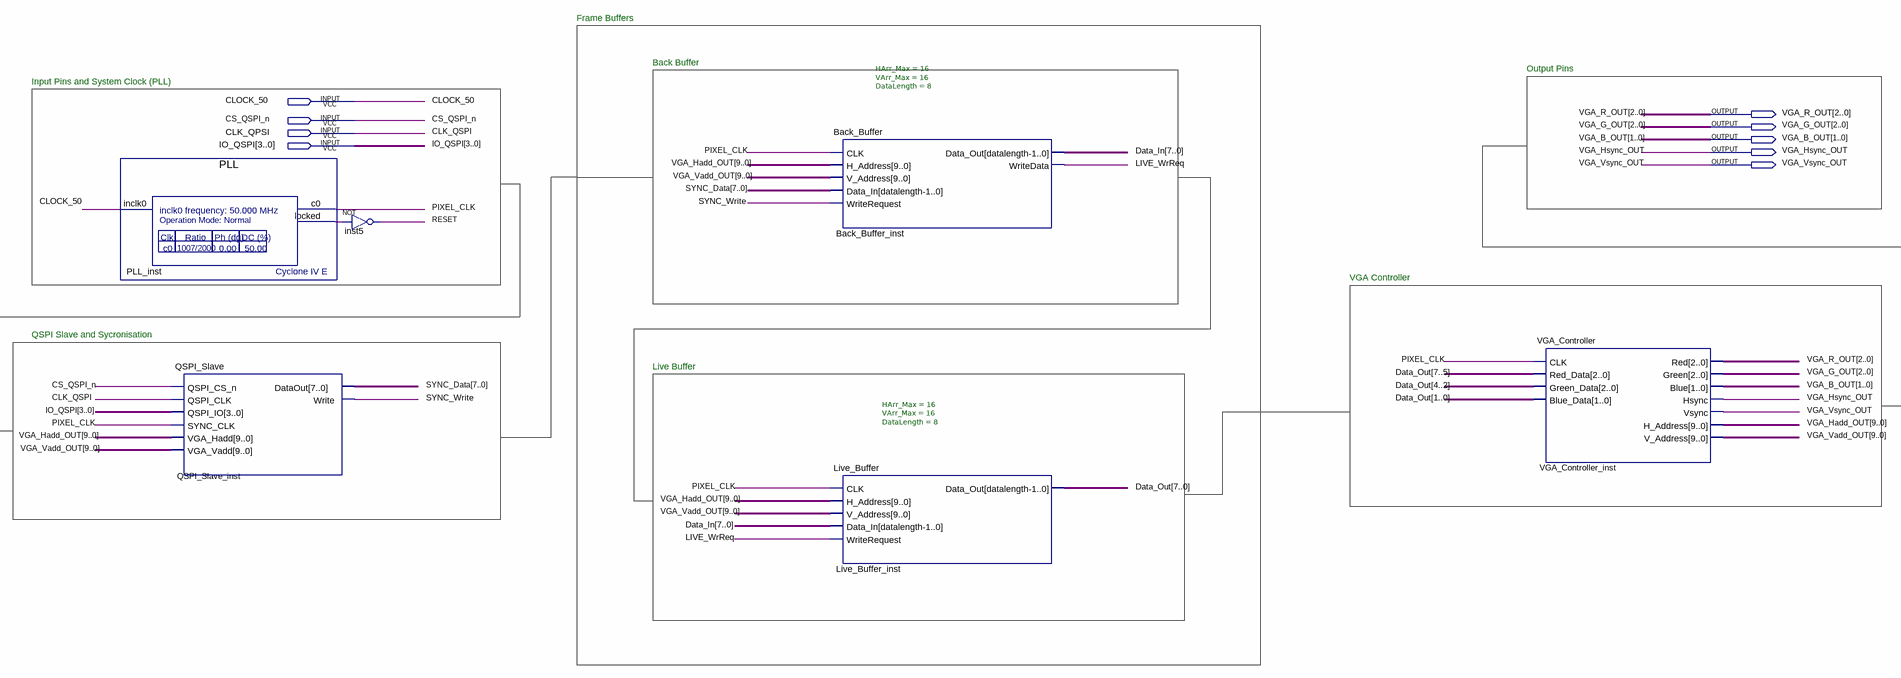
[diagram p0: schematic sheet]
// Quartus schematic FinalYearProject.bdf as structural Verilog: 6 symbols, 9 pins
module FinalYearProject (
  input  CLOCK_50,
  input  CS_QSPI_n,
  input  CLK_QPSI,
  input  [3:0] IO_QSPI,
  output [2:0] VGA_R_OUT,
  output [2:0] VGA_G_OUT,
  output [1:0] VGA_B_OUT,
  output VGA_Hsync_OUT,
  output VGA_Vsync_OUT
);

  wire LIVE_WrReq, PIXEL_CLK, PLL_inst_locked, RESET, SYNC_Write;
  wire [7:0] Data_In, Data_Out, SYNC_Data;
  wire [9:0] VGA_Hadd_OUT, VGA_Vadd_OUT;

  PLL PLL_inst (.inclk0(CLOCK_50), .c0(PIXEL_CLK), .locked(PLL_inst_locked));
  QSPI_Slave QSPI_Slave_inst (
    .QSPI_CS_n(CS_QSPI_n), .QSPI_CLK(CLK_QPSI), .QSPI_IO(IO_QSPI), .SYNC_CLK(PIXEL_CLK),
    .VGA_Hadd(VGA_Hadd_OUT), .VGA_Vadd(VGA_Vadd_OUT), .DataOut(SYNC_Data), .Write(SYNC_Write));
  not inst5 (RESET, PLL_inst_locked);
  Back_Buffer #(.HArr_Max(16), .VArr_Max(16), .DataLength(8)) Back_Buffer_inst (
    .CLK(PIXEL_CLK), .H_Address(VGA_Hadd_OUT), .V_Address(VGA_Vadd_OUT), .Data_In(SYNC_Data),
    .WriteRequest(SYNC_Write), .Data_Out(Data_In), .WriteData(LIVE_WrReq));
  Live_Buffer #(.HArr_Max(16), .VArr_Max(16), .DataLength(8)) Live_Buffer_inst (
    .CLK(PIXEL_CLK), .H_Address(VGA_Hadd_OUT), .V_Address(VGA_Vadd_OUT), .Data_In(Data_In),
    .WriteRequest(LIVE_WrReq), .Data_Out(Data_Out));
  VGA_Controller VGA_Controller_inst (
    .CLK(PIXEL_CLK), .Red_Data(Data_Out[7:5]), .Green_Data(Data_Out[4:2]), .Blue_Data(Data_Out[1:0]),
    .Red(VGA_R_OUT), .Green(VGA_G_OUT), .Blue(VGA_B_OUT), .Hsync(VGA_Hsync_OUT), .Vsync(VGA_Vsync_OUT),
    .H_Address(VGA_Hadd_OUT), .V_Address(VGA_Vadd_OUT));

  // Other names for the same wires on the sheet: CLK_QSPI = CLK_QPSI

  // Notes on the sheet:
  //   Frame Buffers
  //   Back Buffer
  //   Output Pins
  //   Input Pins and System Clock (PLL)
  //   VGA Controller
  //   QSPI Slave and Sycronisation
  //   Live Buffer
endmodule
